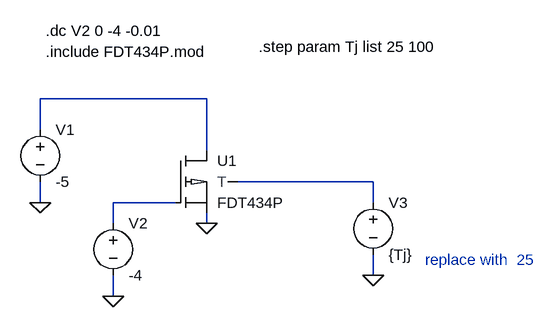
[diagram p0: schematic FDT434P_test.asc]
FDT434P_test.asc, the LTspice schematic file:
Version 4
SHEET 1 880 680
WIRE 80 144 -176 144
WIRE -176 192 -176 144
WIRE 80 224 80 144
WIRE 336 272 128 272
WIRE -176 304 -176 272
WIRE 32 304 -64 304
WIRE 336 304 336 272
WIRE -64 336 -64 304
WIRE 80 336 80 320
WIRE 336 416 336 384
WIRE -64 448 -64 416
FLAG -176 304 0
FLAG 80 336 0
FLAG -64 448 0
FLAG 336 416 0
SYMBOL voltage -176 176 R0
SYMATTR InstName V1
SYMATTR Value -5
SYMBOL voltage -64 320 R0
SYMATTR InstName V2
SYMATTR Value -4
SYMBOL voltage 336 288 R0
SYMATTR InstName V3
SYMATTR Value {Tj}
SYMBOL xpmos4_T 32 224 R0
SYMATTR InstName U1
SYMATTR SpiceModel FDT434P
TEXT -168 72 Left 0 !.include FDT434P.mod
TEXT -168 40 Left 0 !.dc V2 0 -4 -0.01
TEXT 160 64 Left 0 !.step param Tj list 25 100
TEXT 416 392 Left 0 ;replace with  25

The netlist it stands for:
* FDT434P_test.asc
V1 N001 0 -5
V2 N003 0 -4
V3 N002 0 {Tj}
XU1 N001 N003 0 N002 FDT434P  ; pins D G S T
.include FDT434P.mod
.dc V2 0 -4 -0.01
.step param Tj list 25 100
* replace with  25
.backanno
.end